# EAGLE design cart_schem (EAGLE 7.7.0)
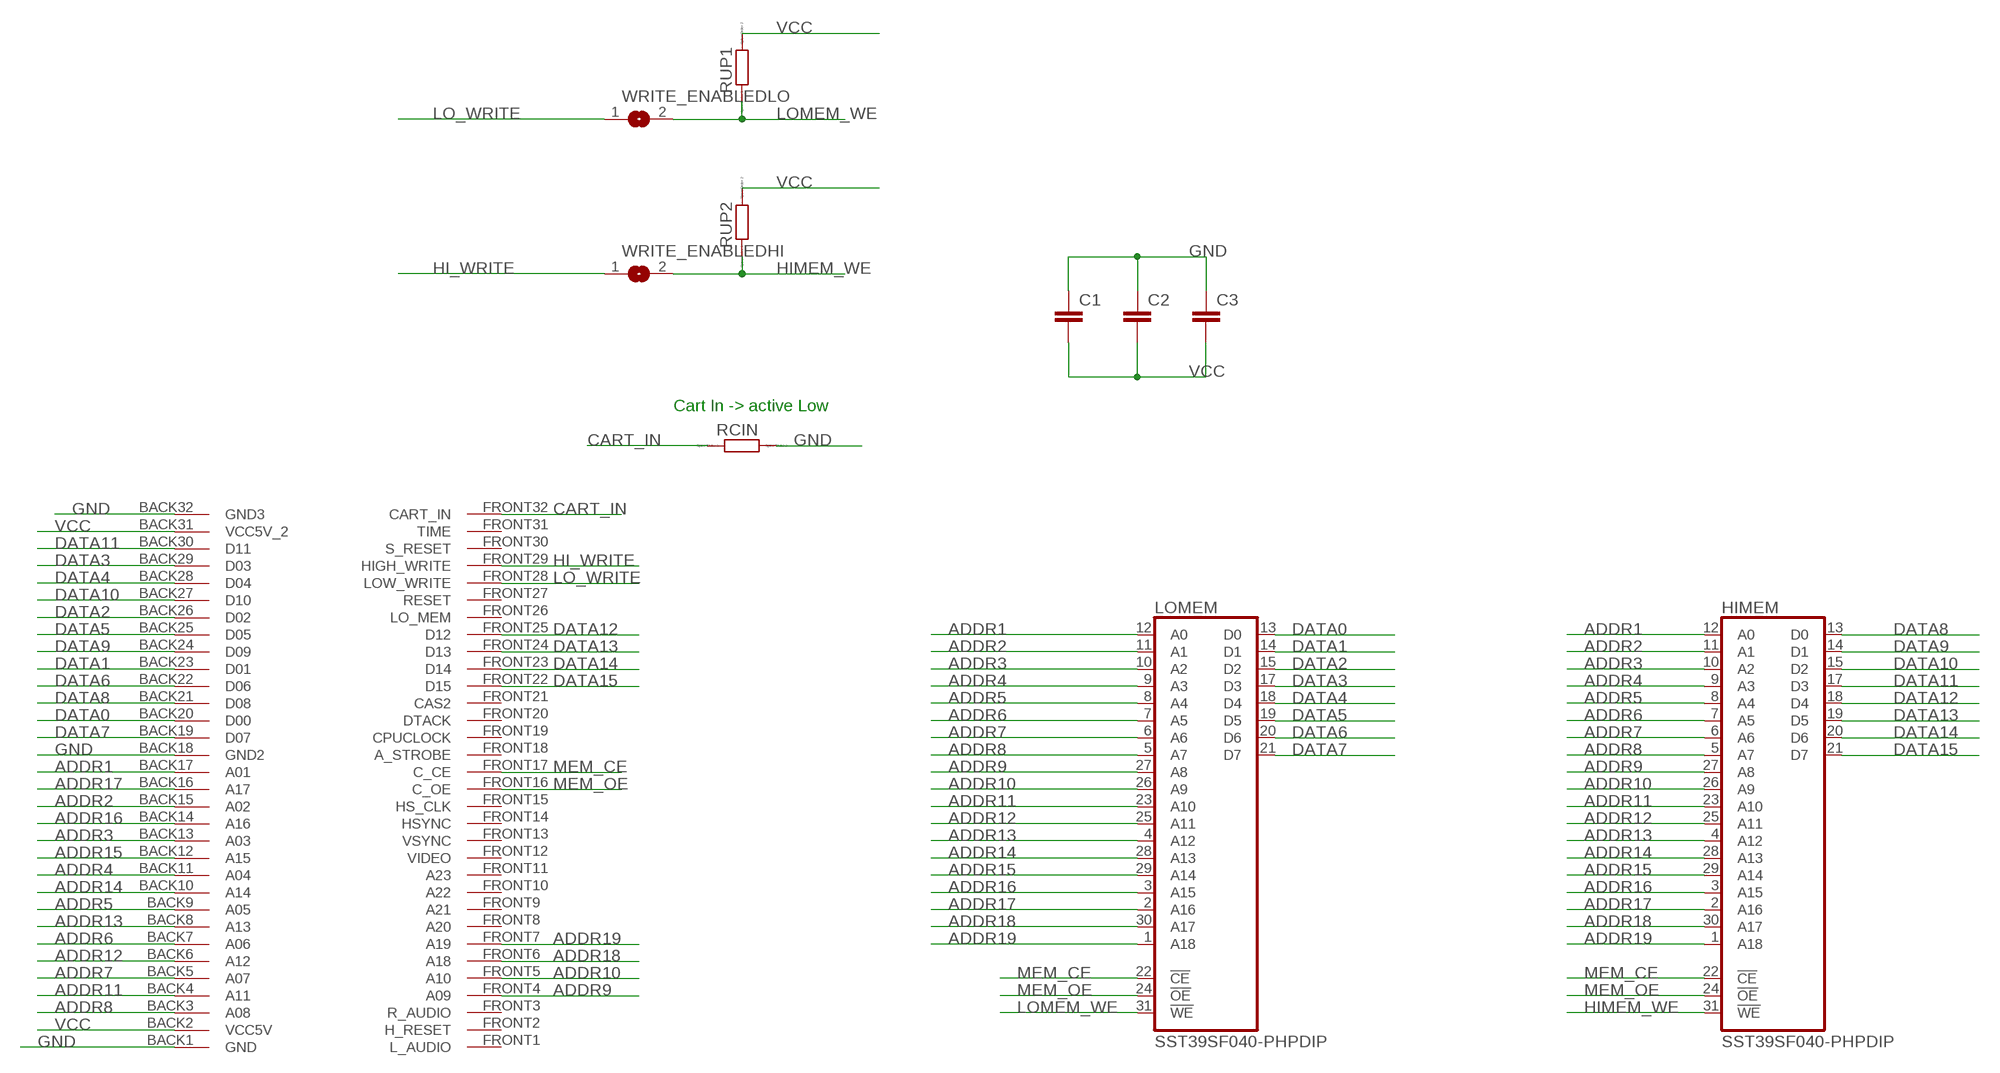
[diagram p0: schematic, sheet 1]

## Parts
C1  C-EU025-024X044  [C025-024X044]
C2  C-EU025-024X044  [C025-024X044]
C3  C-EU025-024X044  [C025-024X044]
HIMEM  SST39SF040-PHPDIP  [DIL32]
LOMEM  SST39SF040-PHPDIP  [DIL32]
MD1  MEGADRIVE-CART  [MEGADRIVE-SLOT-PACKAGE]
RCIN  R0207/10  [0207/10]
RUP1  R0207/10  [0207/10]
RUP2  R0207/10  [0207/10]
WRITE_ENABLEDHI  SJ  [SJ]
WRITE_ENABLEDLO  SJ  [SJ]

## Nets
ADDR1: HIMEM.12(A0) LOMEM.12(A0) MD1.BACK17(A01)
ADDR2: HIMEM.11(A1) LOMEM.11(A1) MD1.BACK15(A02)
ADDR3: HIMEM.10(A2) LOMEM.10(A2) MD1.BACK13(A03)
ADDR4: HIMEM.9(A3) LOMEM.9(A3) MD1.BACK11(A04)
ADDR5: HIMEM.8(A4) LOMEM.8(A4) MD1.BACK9(A05)
ADDR6: HIMEM.7(A5) LOMEM.7(A5) MD1.BACK7(A06)
ADDR7: HIMEM.6(A6) LOMEM.6(A6) MD1.BACK5(A07)
ADDR8: HIMEM.5(A7) LOMEM.5(A7) MD1.BACK3(A08)
ADDR9: HIMEM.27(A8) LOMEM.27(A8) MD1.FRONT4(A09)
ADDR10: HIMEM.26(A9) LOMEM.26(A9) MD1.FRONT5(A10)
ADDR11: HIMEM.23(A10) LOMEM.23(A10) MD1.BACK4(A11)
ADDR12: HIMEM.25(A11) LOMEM.25(A11) MD1.BACK6(A12)
ADDR13: HIMEM.4(A12) LOMEM.4(A12) MD1.BACK8(A13)
ADDR14: HIMEM.28(A13) LOMEM.28(A13) MD1.BACK10(A14)
ADDR15: HIMEM.29(A14) LOMEM.29(A14) MD1.BACK12(A15)
ADDR16: HIMEM.3(A15) LOMEM.3(A15) MD1.BACK14(A16)
ADDR17: HIMEM.2(A16) LOMEM.2(A16) MD1.BACK16(A17)
ADDR18: HIMEM.30(A17) LOMEM.30(A17) MD1.FRONT6(A18)
ADDR19: HIMEM.1(A18) LOMEM.1(A18) MD1.FRONT7(A19)
CART_IN: MD1.FRONT32(CART_IN) RCIN.1
DATA0: LOMEM.13(D0) MD1.BACK20(D00)
DATA1: LOMEM.14(D1) MD1.BACK23(D01)
DATA2: LOMEM.15(D2) MD1.BACK26(D02)
DATA3: LOMEM.17(D3) MD1.BACK29(D03)
DATA4: LOMEM.18(D4) MD1.BACK28(D04)
DATA5: LOMEM.19(D5) MD1.BACK25(D05)
DATA6: LOMEM.20(D6) MD1.BACK22(D06)
DATA7: LOMEM.21(D7) MD1.BACK19(D07)
DATA8: HIMEM.13(D0) MD1.BACK21(D08)
DATA9: HIMEM.14(D1) MD1.BACK24(D09)
DATA10: HIMEM.15(D2) MD1.BACK27(D10)
DATA11: HIMEM.17(D3) MD1.BACK30(D11)
DATA12: HIMEM.18(D4) MD1.FRONT25(D12)
DATA13: HIMEM.19(D5) MD1.FRONT24(D13)
DATA14: HIMEM.20(D6) MD1.FRONT23(D14)
DATA15: HIMEM.21(D7) MD1.FRONT22(D15)
GND: C1.1 C2.1 C3.1 MD1.BACK1(GND) MD1.BACK18(GND2) MD1.BACK32(GND3) RCIN.2
HI_WRITE: MD1.FRONT29(HIGH_WRITE) WRITE_ENABLEDHI.1
HIMEM_WE: HIMEM.31(!WE) RUP2.1 WRITE_ENABLEDHI.2
LO_WRITE: MD1.FRONT28(LOW_WRITE) WRITE_ENABLEDLO.1
LOMEM_WE: LOMEM.31(!WE) RUP1.1 WRITE_ENABLEDLO.2
MEM_CE: HIMEM.22(!CE) LOMEM.22(!CE) MD1.FRONT17(C_CE)
MEM_OE: HIMEM.24(!OE) LOMEM.24(!OE) MD1.FRONT16(C_OE)
VCC: C1.2 C2.2 C3.2 MD1.BACK2(VCC5V) MD1.BACK31(VCC5V_2) RUP1.2 RUP2.2
Unconnected: MD1.FRONT1(L_AUDIO) MD1.FRONT2(H_RESET) MD1.FRONT3(R_AUDIO) MD1.FRONT8(A20) MD1.FRONT9(A21) MD1.FRONT10(A22) MD1.FRONT11(A23) MD1.FRONT12(VIDEO) MD1.FRONT13(VSYNC) MD1.FRONT14(HSYNC) MD1.FRONT15(HS_CLK) MD1.FRONT18(A_STROBE) MD1.FRONT19(CPUCLOCK) MD1.FRONT20(DTACK) MD1.FRONT21(CAS2) MD1.FRONT26(LO_MEM) MD1.FRONT27(RESET) MD1.FRONT30(S_RESET) MD1.FRONT31(TIME)

## Notes on the sheet
- Cart In -> active Low

## Power pins joined to a net without a drawn wire
GND: HIMEM.16(GND) LOMEM.16(GND)
VCC: HIMEM.32(VCC) LOMEM.32(VCC)

## Library data of the parts
C1-C3 = resistor:C-EU: CAPACITOR, European symbol
HIMEM LOMEM = memory_david:SST39SF040-PH: 4 Mbit x8 Multi-Purpose Flash Source: http://www.sst.com/dotAsset/40782.pdf
MD1 = megadrive:MEGADRIVE-CART: Megadrive cartridge interface that fits in a slot
RCIN RUP1 RUP2 = eagle-ltspice:R: RESISTOR, European symbol; SPICEMODEL: NONE; SPICEPREFIX: R
WRITE_ENABLEDHI WRITE_ENABLEDLO = jumper:SJ: SMD solder JUMPER

## Board
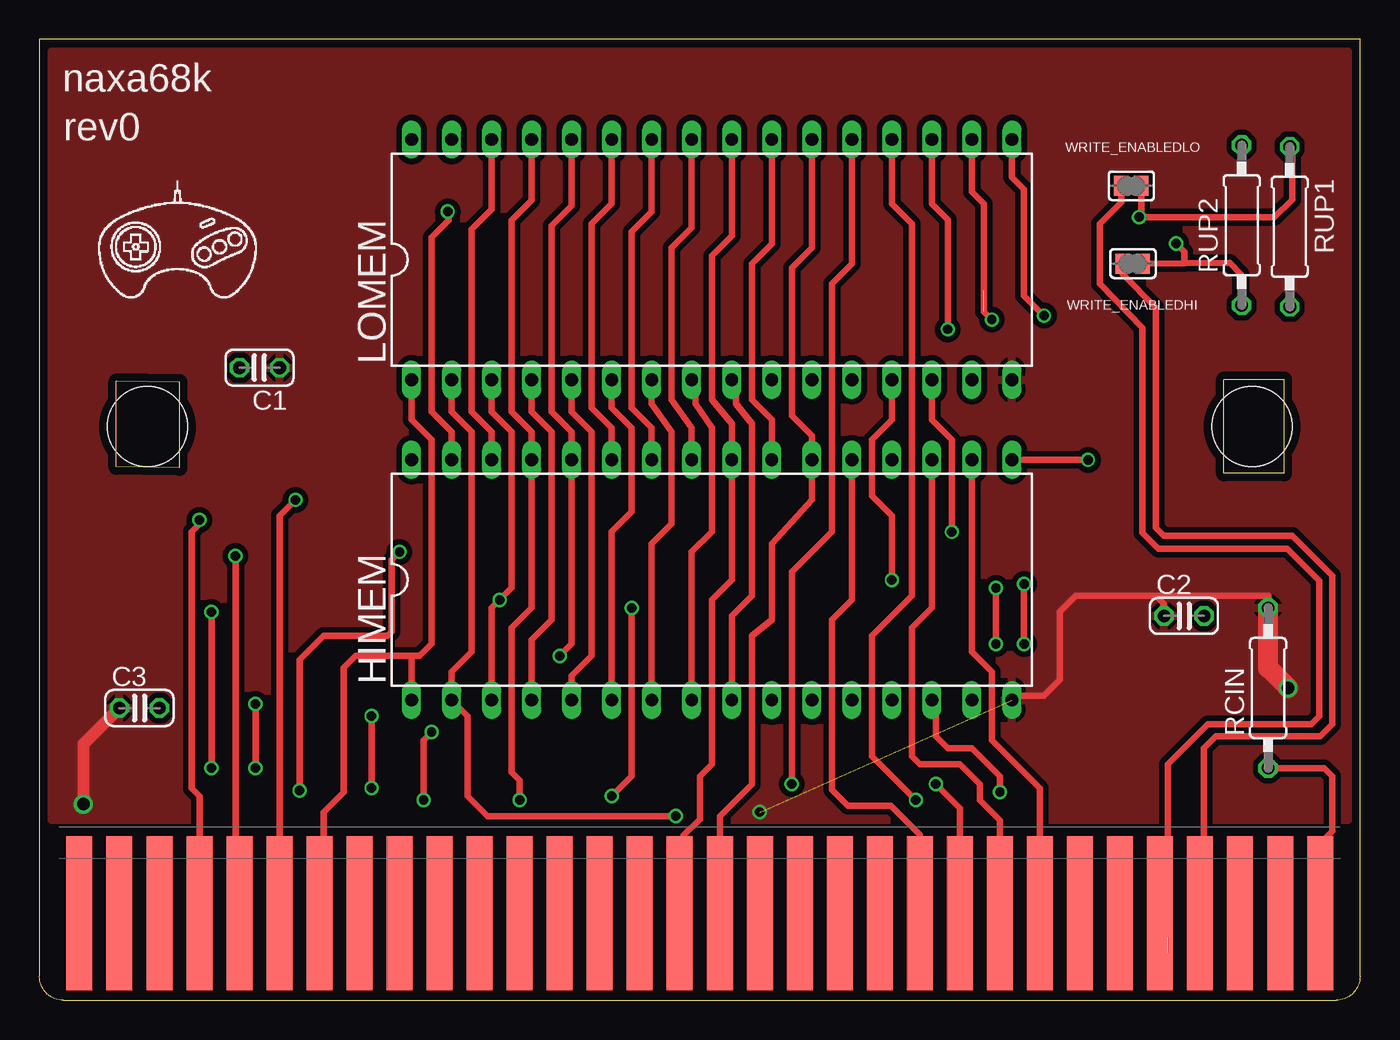
[diagram p1: board, top side]
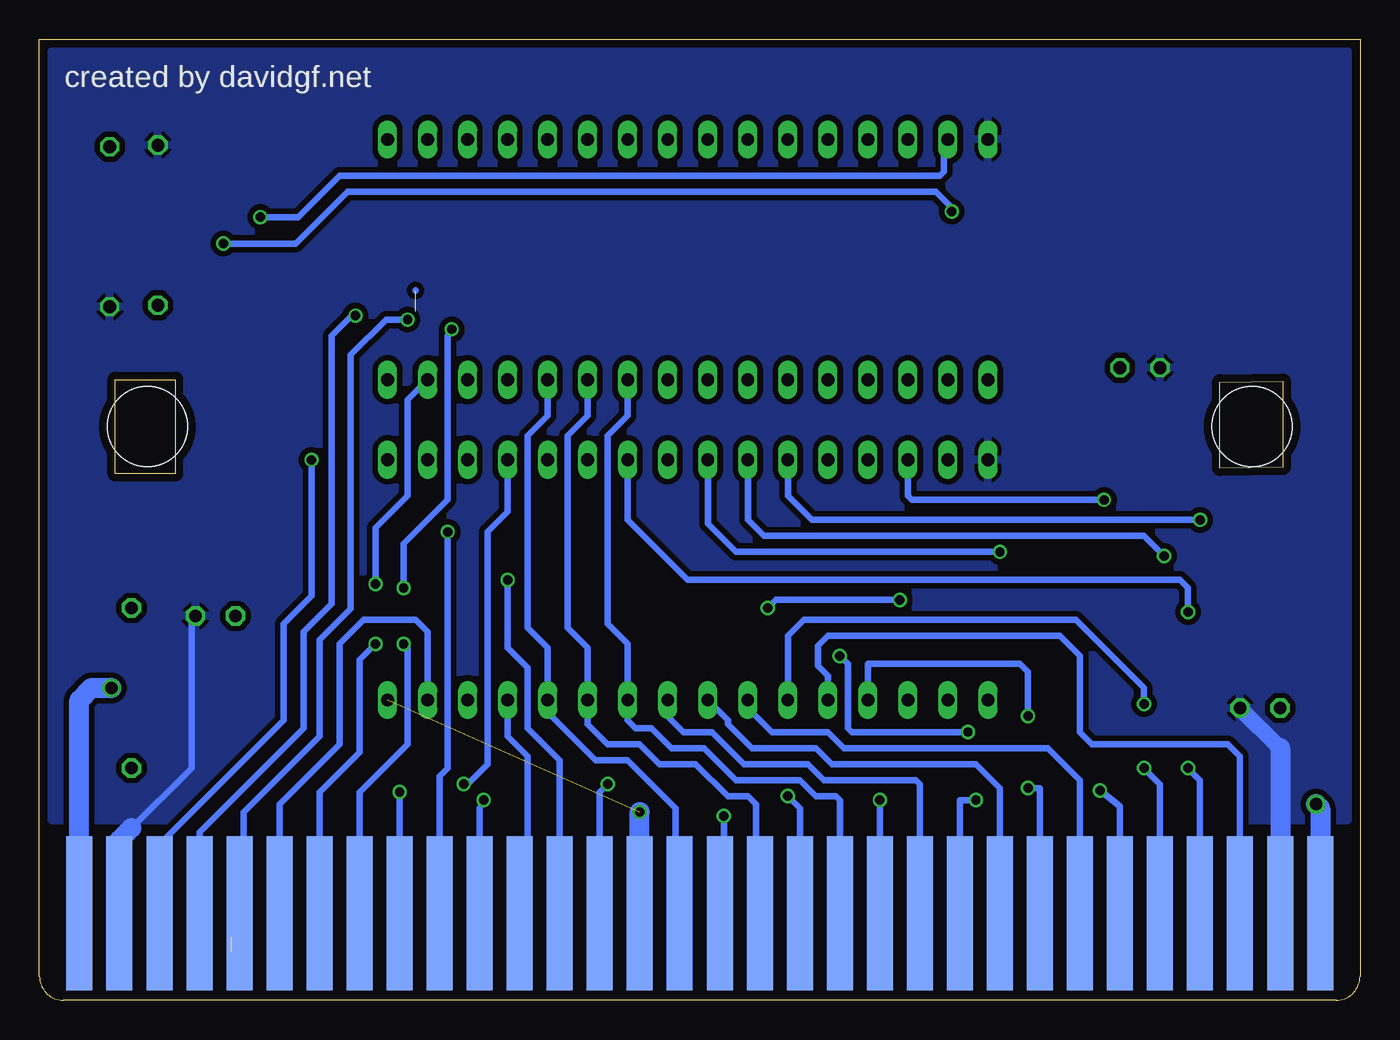
[diagram p2: board, bottom side, seen from below]

Size 83.82 x 60.96 mm. Coordinates in mm from the lower left corner, seen from the top.
Outline: 1.52,0 82.3,0 arc90 83.82,1.52 83.82,60.96 0,60.96 0,1.52 arc90 1.52,0
Outline: 75.18,33.43 75.18,39.37 78.99,39.37 78.99,33.43 75.18,33.43
Outline: 8.89,33.78 4.88,33.83 4.88,39.27 8.89,39.22 8.89,33.78
Copper layers (1*16): Top 0.035mm / dielectric 1.6mm / Bottom 0.035mm
Design rules "Elecrow_2-layer_PCB_eagle_rule *": minimum track width 16mil, minimum drill 15mil, track to track 14mil, track to pad 14mil, pad to pad 14mil, via to via 14mil, smd to smd 0mil, copper to edge 20mil, drill to drill 10mil, minimum pad ring 6mil, minimum via ring 6mil, stop-mask expansion 0mil, vias tented up to drill 100mil, thermal gap 10mil
Holes 5.08 mm at 6.86,36.4 76.96,36.4

### Footprints (pad centres in the part's own frame; a part is rotated, then mirrored left to right if it is on the bottom)
C025-024X044 = drill 0.813 octagon: 1 -1.27,0; 2 1.27,0
DIL32 = drill 0.813 long: 1 -19.05,-7.62; 2 -16.51,-7.62; 3 -13.97,-7.62; 4 -11.43,-7.62; 5 -8.89,-7.62; 6 -6.35,-7.62; 7 -3.81,-7.62; 8 -1.27,-7.62; 9 1.27,-7.62; 10 3.81,-7.62; 11 6.35,-7.62; 12 8.89,-7.62; 13 11.43,-7.62; 14 13.97,-7.62; 15 16.51,-7.62; 16 19.05,-7.62; 17 19.05,7.62; 18 16.51,7.62; 19 13.97,7.62; 20 11.43,7.62; 21 8.89,7.62; 22 6.35,7.62; 23 3.81,7.62; 24 1.27,7.62; 25 -1.27,7.62; 26 -3.81,7.62; 27 -6.35,7.62; 28 -8.89,7.62; 29 -11.43,7.62; 30 -13.97,7.62; 31 -16.51,7.62; 32 -19.05,7.62
MEGADRIVE-SLOT-PACKAGE = smd 1.651 x 9.779 bottom: BACK1 -39.37,5.524; BACK2 -36.83,5.524; BACK3 -34.29,5.524; BACK4 -31.75,5.524; BACK5 -29.21,5.524; BACK6 -26.67,5.524; BACK7 -24.13,5.524; BACK8 -21.59,5.524; BACK9 -19.05,5.524; BACK10 -16.51,5.524; BACK11 -13.97,5.524; BACK12 -11.43,5.524; BACK13 -8.89,5.524; BACK14 -6.35,5.524; BACK15 -3.81,5.524; BACK16 -1.27,5.524; BACK17 1.27,5.524; BACK18 3.81,5.524; BACK19 6.35,5.524; BACK20 8.89,5.524; BACK21 11.43,5.524; BACK22 13.97,5.524; BACK23 16.51,5.524; BACK24 19.05,5.524; BACK25 21.59,5.524; BACK26 24.13,5.524; BACK27 26.67,5.524; BACK28 29.21,5.524; BACK29 31.75,5.524; BACK30 34.29,5.524; BACK31 36.83,5.524; BACK32 39.37,5.524 | smd 1.651 x 9.779: FRONT1 -39.37,5.524; FRONT2 -36.83,5.524; FRONT3 -34.29,5.524; FRONT4 -31.75,5.524; FRONT5 -29.21,5.524; FRONT6 -26.67,5.524; FRONT7 -24.13,5.524; FRONT8 -21.59,5.524; FRONT9 -19.05,5.524; FRONT10 -16.51,5.524; FRONT11 -13.97,5.524; FRONT12 -11.43,5.524; FRONT13 -8.89,5.524; FRONT14 -6.35,5.524; FRONT15 -3.81,5.524; FRONT16 -1.27,5.524; FRONT17 1.27,5.524; FRONT18 3.81,5.524; FRONT19 6.35,5.524; FRONT20 8.89,5.524; FRONT21 11.43,5.524; FRONT22 13.97,5.524; FRONT23 16.51,5.524; FRONT24 19.05,5.524; FRONT25 21.59,5.524; FRONT26 24.13,5.524; FRONT27 26.67,5.524; FRONT28 29.21,5.524; FRONT29 31.75,5.524; FRONT30 34.29,5.524; FRONT31 36.83,5.524; FRONT32 39.37,5.524
0207/10 = drill 0.813 octagon: 1 -5.08,0; 2 5.08,0
SJ = smd 0.914 x 1.27: 1 -0.635,0; 2 0.635,0

### Placement (x,y rotation side)
C1  13.97,40.13 180 top
C2  72.64,24.38 0 top
C3  6.35,18.54 0 top
HIMEM  42.67,26.67 0 top
LOMEM  42.67,46.99 0 top
MD1  41.91,0 0 top
RCIN  77.98,19.81 90 top
RUP1  79.35,49.07 270 top
RUP2  76.3,49.17 90 top
WRITE_ENABLEDHI  69.39,46.74 0 top
WRITE_ENABLEDLO  69.29,51.66 0 top

### Tracks (layer width: path | path; a pad name or v marks a point on that pad's centre or on a via)
ADDR1
  Bottom 0.406: LOMEM.12 51.56,37.08 52.83,35.81 52.83,23.62 51.56,22.35 HIMEM.12 | HIMEM.12 51.31,18.8 | MD1.BACK17 43.43,5.02 43.43,12.19 46.48,15.24 48.51,15.24 51.56,18.29 HIMEM.12
ADDR2
  Bottom 0.406: LOMEM.11 49.02,37.08 50.29,35.81 50.29,23.62 49.02,22.35 HIMEM.11 | HIMEM.11 48.77,18.8 | MD1.BACK15 38.35,5.02 38.35,12.45 38.86,12.95 40.13,12.95 42.16,14.99 44.45,14.99 45.72,16.26 47.75,16.26 49.02,17.53 HIMEM.11
ADDR3
  Bottom 0.406: LOMEM.10 46.48,37.08 47.75,35.81 47.75,23.88 46.48,22.61 HIMEM.10 46.48,17.78 45.97,17.27 44.96,17.27 43.69,16 41.66,16 39.62,13.97 35.56,13.97 34.54,12.95 33.27,12.95 33.02,12.7 MD1.BACK13
ADDR4
  Top 0.406: LOMEM.9 44.2,39.12 44.2,37.85 45.21,36.58 45.21,25.65 43.94,24.38 HIMEM.9
  Bottom 0.406: MD1.BACK11 27.94,13.72 28.19,13.97 34.04,13.97 35.05,14.99 39.12,14.99 41.15,17.02 42.93,17.02 43.94,18.03 HIMEM.9
ADDR5
  Top 0.406: LOMEM.8 41.66,39.12 41.66,37.85 42.67,36.32 42.67,29.72 41.4,28.45 HIMEM.8
  Bottom 0.406: HIMEM.8 40.13,17.78 40.13,17.53 38.61,16 34.54,16 33.53,14.99 24.38,14.99 22.86,13.46 MD1.BACK9
ADDR6
  Top 0.406: LOMEM.7 38.86,37.85 40.13,36.07 40.13,30.23 38.86,28.96 HIMEM.7
  Bottom 0.406: MD1.BACK7 17.78,13.97 19.81,16 32.77,16 33.78,17.02 37.34,17.02 38.86,18.54 HIMEM.7
ADDR7  (via drill 0.6)
  Top 0.406: LOMEM.6 36.32,37.59 37.59,36.32 37.59,30.99 36.32,29.72 HIMEM.6 | v13.72,18.8 v13.72,14.73
  Bottom 0.406: HIMEM.6 36.32,23.11 35.31,24.13 18.03,24.13 13.72,19.81 v13.72,18.8 | v13.72,14.73 12.7,13.72 MD1.BACK5
ADDR8
  Top 0.406: LOMEM.5 33.78,37.34 35.05,36.07 35.05,21.84 33.78,20.57 HIMEM.5
  Bottom 0.406: MD1.BACK3 7.62,15.49 8.38,16.26 17.02,16.26 17.78,17.02 17.78,21.84 19.05,23.11 33.78,23.11 34.42,22.48 34.42,21.21 33.78,20.57 HIMEM.5
ADDR9  (via drill 0.6)
  Top 0.406: LOMEM.27 36.32,50.55 35.05,49.28 35.05,37.59 36.32,36.32 HIMEM.27 | MD1.FRONT4 10.16,12.95 9.65,13.46 9.65,29.72 10.16,30.23 v10.16,30.48
  Bottom 0.406: HIMEM.27 36.32,32 34.8,30.48 v10.16,30.48
ADDR10  (via drill 0.6)
  Top 0.406: LOMEM.26 38.86,50.04 37.59,48.77 37.59,37.59 38.86,36.32 HIMEM.26 | v12.45,28.19 12.45,4.57 12.7,4.32 MD1.FRONT5
  Bottom 0.406: HIMEM.26 38.86,30.48 37.85,29.46 13.72,29.46 v12.45,28.19
ADDR11  (via drill 0.6)
  Top 0.406: LOMEM.23 46.48,48.01 45.21,46.74 45.21,38.1 46.48,36.83 HIMEM.23 | v10.92,24.64 v10.92,14.73
  Bottom 0.406: MD1.BACK4 10.16,13.97 v10.92,14.73 | HIMEM.23 46.48,30.48 42.67,26.67 11.43,26.67 10.92,26.16 v10.92,24.64
ADDR12  (via drill 0.6)
  Top 0.406: LOMEM.25 41.4,49.02 40.13,47.75 40.13,38.1 41.4,36.32 HIMEM.25 | v22.86,28.45 22.35,27.94 22.35,23.37 22.1,23.11 18.03,23.11 16.51,21.59 v16.51,13.31
  Bottom 0.406: MD1.BACK6 15.24,12.29 v16.51,13.31 | HIMEM.25 41.4,30.23 39.62,28.45 v22.86,28.45
ADDR13  (via drill 0.6)
  Top 0.406: LOMEM.4 31.24,37.34 32.51,36.07 32.51,24.13 31.24,22.86 HIMEM.4 | v21.08,18.03 v21.08,13.46
  Bottom 0.406: HIMEM.4 31.24,21.34 21.59,21.34 21.08,20.83 v21.08,18.03 | v21.08,13.46 20.32,13.46 MD1.BACK8
ADDR14  (via drill 0.6)
  Top 0.406: LOMEM.28 33.78,50.39 32.51,49.12 32.51,37.34 33.78,36.07 HIMEM.28 | 33.78,35.31 HIMEM.28 | v24.89,17.02 24.38,16.51 v24.38,12.7 | HIMEM.28 33.78,22.61 v33.02,21.84
  Bottom 0.406: MD1.BACK10 25.4,12.7 v24.38,12.7 | v24.89,17.02 32.26,17.02 32.51,17.27 32.51,21.34 v33.02,21.84
ADDR15  (via drill 0.6)
  Top 0.406: LOMEM.29 31.24,50.75 29.97,49.48 29.97,37.34 31.24,36.07 HIMEM.29 31.24,24.89 29.97,23.62 29.97,14.48 30.48,13.97 v30.48,12.7
  Bottom 0.406: v30.48,12.7 MD1.BACK12
ADDR16  (via drill 0.6)
  Top 0.406: LOMEM.3 28.7,37.34 29.97,36.07 29.97,26.16 v29.21,25.4 28.7,24.89 HIMEM.3 | v36.32,12.95 37.59,14.22 v37.59,24.89
  Bottom 0.406: v37.59,24.89 37.08,25.4 v29.21,25.4 | v36.32,12.95 35.56,12.19 MD1.BACK14
ADDR17  (via drill 0.6)
  Top 0.406: LOMEM.2 26.16,37.34 27.43,36.07 27.43,22.1 26.16,20.83 HIMEM.2 27.18,18.03 27.18,12.95 28.45,11.68 v40.39,11.68
  Bottom 0.406: v40.39,11.68 40.39,5.02 MD1.BACK16
ADDR18  (via drill 0.6)
  Top 0.406: LOMEM.30 28.7,50.19 27.43,48.92 27.43,37.34 28.7,36.07 HIMEM.30 | v16.26,31.75 15.24,30.73 MD1.FRONT6 | MD1.FRONT6 15.24,2.79 14.99,3.05 14.99,4.06 15.24,3.81 MD1.FRONT6
  Bottom 0.406: HIMEM.30 28.7,32 28.45,31.75 v16.26,31.75
ADDR19
  Top 0.406: MD1.FRONT7 18.03,3.24 18.03,11.94 19.3,13.21 19.3,21.08 20.07,21.84 23.62,21.84 | 23.62,21.84 HIMEM.1 | LOMEM.1 23.62,36.83 24.89,35.56 24.89,22.61 24.13,21.84 23.62,21.84
CART_IN
  Top 0.406: RCIN.1 81.53,14.73 82.04,14.22 82.04,10.72 81.53,10.21 81.53,3.24 MD1.FRONT32
DATA0  (via drill 0.6)
  Top 0.406: LOMEM.13 54.1,36.83 52.83,35.56 52.83,32 54.1,30.73 v54.1,26.67
  Bottom 0.406: v54.1,26.67 54.1,22.35 52.83,21.08 52.83,17.27 50.8,15.24 MD1.BACK20
DATA1  (via drill 0.6)
  Top 0.406: LOMEM.14 56.64,36.83 57.91,35.56 v57.91,29.72
  Bottom 0.406: v57.91,29.72 57.91,14.73 58.42,14.22 MD1.BACK23
DATA2  (via drill 0.6)
  Top 0.406: v62.48,26.42 v62.48,22.61
  Bottom 0.406: LOMEM.15 60.45,38.1 60.45,32 62.48,29.97 v62.48,26.42 | v62.48,22.61 63.5,21.59 63.5,15.75 66.04,13.21 MD1.BACK26
DATA3  (via drill 0.6)
  Top 0.406: LOMEM.17 61.72,52.22 62.48,51.46 62.48,44.7 v63.75,43.43
  Bottom 0.406: 73.41,3.75 MD1.BACK29 73.66,10.67 67.06,17.27 67.06,23.37 65.28,25.15 65.28,42.16 64.01,43.43 v63.75,43.43
DATA4  (via drill 0.6)  (1 unrouted)
  Top 0.406: LOMEM.18 59.18,51.31 59.94,50.55 59.94,43.69 v60.45,43.18
  Bottom 0.406: 59.94,45.01 59.94,45.06 | MD1.BACK28 70.87,3.75 70.87,11.94 66.04,16.76 66.04,22.86 64.06,24.84 64.06,40.95 61.82,43.18 v60.45,43.18
DATA5  (via drill 0.6)
  Top 0.406: LOMEM.19 56.64,50.55 57.66,49.53 v57.66,42.57 | v60.71,26.16 v60.71,22.61
  Bottom 0.406: v57.66,42.57 57.91,42.16 57.91,31.75 60.71,28.96 v60.71,26.16 | MD1.BACK25 63.5,13.21 60.45,16.26 60.45,22.35 v60.71,22.61
DATA6  (via drill 0.6)
  Top 0.406: LOMEM.20 54.1,50.55 55.37,49.28 55.37,25.65 52.83,23.11 52.83,15.49 v55.63,12.7
  Bottom 0.406: MD1.BACK22 55.88,12.19 v55.63,12.7
DATA7  (via drill 0.6)
  Top 0.406: LOMEM.21 51.56,46.74 50.29,45.47 50.29,29.72 47.75,27.18 v47.75,13.72
  Bottom 0.406: v47.75,13.72 48.26,13.21 MD1.BACK19
DATA8
  Bottom 0.406: HIMEM.13 54.1,16.76 52.83,15.49 52.83,4 MD1.BACK21
DATA9  (via drill 0.6)
  Top 0.406: HIMEM.14 56.9,18.8 56.9,16.76 57.66,16 59.18,16 60.96,14.22 v60.96,13.21
  Bottom 0.406: v60.96,13.21 MD1.BACK24
DATA10
  Bottom 0.406: HIMEM.15 59.18,23.37 59.94,24.13 63.25,24.13 64.77,22.61 64.77,16.26 68.58,12.45 MD1.BACK27
DATA11  (via drill 0.6)
  Top 0.406: HIMEM.17 v66.55,34.29
  Bottom 0.406: v66.55,34.29 66.55,25.65 68.33,23.88 68.33,17.78 76.2,9.91 MD1.BACK30
DATA12
  Top 0.406: HIMEM.18 59.18,22.1 60.45,20.83 60.45,16.51 63.5,13.46 MD1.FRONT25
DATA13
  Top 0.406: HIMEM.19 56.64,24.89 55.37,23.62 55.37,15.49 55.88,14.99 58.42,14.99 59.69,13.72 59.69,12.7 60.96,11.43 MD1.FRONT24 60.96,2.79
DATA14  (via drill 0.6)
  Top 0.406: v56.9,13.72 58.42,12.19 MD1.FRONT23
  Bottom 0.406: HIMEM.20 54.1,30.99 55.37,29.72 55.37,14.99 56.64,13.72 v56.9,13.72
DATA15
  Top 0.406: HIMEM.21 51.56,25.4 50.29,24.13 50.29,13.36 51.31,12.34 54.05,12.34 55.88,10.52 MD1.FRONT22
GND  (via drill 0.6, 0.8)  (1 unrouted)
  Top 0.406: 61.98,18.8 HIMEM.16 61.98,19.3 63.75,19.3 64.77,20.32 64.77,24.64 65.79,25.65 70.87,25.65 | 70.87,25.65 71.37,25.15 C2.1 | RCIN.2 77.98,25.65 70.87,25.65
  Top 0.762: C3.1 2.79,16.26 v2.79,12.45
  Top 1.27: v79.25,19.81 77.98,21.08 RCIN.2
  Bottom 1.27: v2.79,12.45 2.54,12.19 MD1.BACK1 | MD1.BACK18 v45.72,11.94 | MD1.BACK32 81.28,19.05 80.52,19.81 v79.25,19.81
  pour Top (isolate 0.254): 0.76,60.2 83.06,60.2 83.06,11.43 0.76,11.43
HI_WRITE
  Top 0.406: WRITE_ENABLEDHI.1 68.76,46.05 70.87,43.94 70.87,29.97 71.37,29.46 79.5,29.46 82.04,26.92 82.04,17.53 81.28,16.76 74.68,16.76 73.91,16 73.91,3.75 MD1.FRONT29
HIMEM_WE  (via drill 0.6)
  Top 0.406: RUP2.1 76.25,44.15 76.25,46.08 75.54,46.79 72.65,46.76 | 72.65,46.76 WRITE_ENABLEDHI.2 | v72.14,48.01 72.65,47.49 72.65,46.76 | v25.91,50.04 25.96,49.99 25.96,49.48 24.89,48.41 24.89,37.34 26.16,36.07 HIMEM.31
  Bottom 0.406: v72.14,48.01 67.56,48.01 64.26,51.31 26.92,51.31 25.91,50.29 v25.91,50.04
LO_WRITE  (1 unrouted)
  Top 0.406: WRITE_ENABLEDLO.1 68.66,50.62 67.31,49.28 67.31,45.47 70,42.67 70,29.67 71.02,28.65 79.2,28.65 81.23,26.62 81.23,18.03 80.72,17.53 74.17,17.53 71.63,14.99 71.63,3.05 71.12,2.54 71.63,2.54 70.61,3.56 70.61,4.57 | 71.63,4 MD1.FRONT28
LOMEM_WE  (via drill 0.6)
  Top 0.406: WRITE_ENABLEDLO.2 69.93,49.81 v69.8,49.68 78.38,49.68 79.5,50.8 79.5,54 RUP1.1
  Bottom 0.406: LOMEM.31 26.42,54.36 26.42,52.58 26.67,52.32 64.77,52.32 67.41,49.68 v69.8,49.68
MEM_CE
  Top 0.406: LOMEM.22 49.02,47.75 47.75,46.48 47.75,37.08 49.02,35.81 HIMEM.22 49.02,31.75 46.48,28.96 46.48,24.13 45.21,23.11 45.21,13.72 43.18,11.68 MD1.FRONT17
MEM_OE
  Top 0.406: LOMEM.24 43.94,48.51 42.67,47.24 42.67,38.1 43.94,36.58 HIMEM.24 43.94,26.67 42.67,25.4 42.67,14.99 41.91,14.22 41.91,11.48 40.89,10.46 40.89,4.06 40.64,3.81 MD1.FRONT16
VCC
  Bottom 0.406: 77.98,10.92 77.72,11.18 | C2.2 74.17,24.13 74.17,14.73 78.23,10.67
  Bottom 1.016: C3.2 5.08,16
  Bottom 1.27: 5.08,16 MD1.BACK2 | 77.98,10.92 78.23,10.67 78.74,10.16 MD1.BACK31
  pour Bottom (isolate 0.254): 0.76,60.2 83.06,60.2 83.06,11.43 0.76,11.43

### Text on the board
tPlace: naxa68k | rev0
bPlace: created by davidgf.net